# EAGLE design mapesynth_2pag (EAGLE 7.6.0)

## Sheet 1 of 2
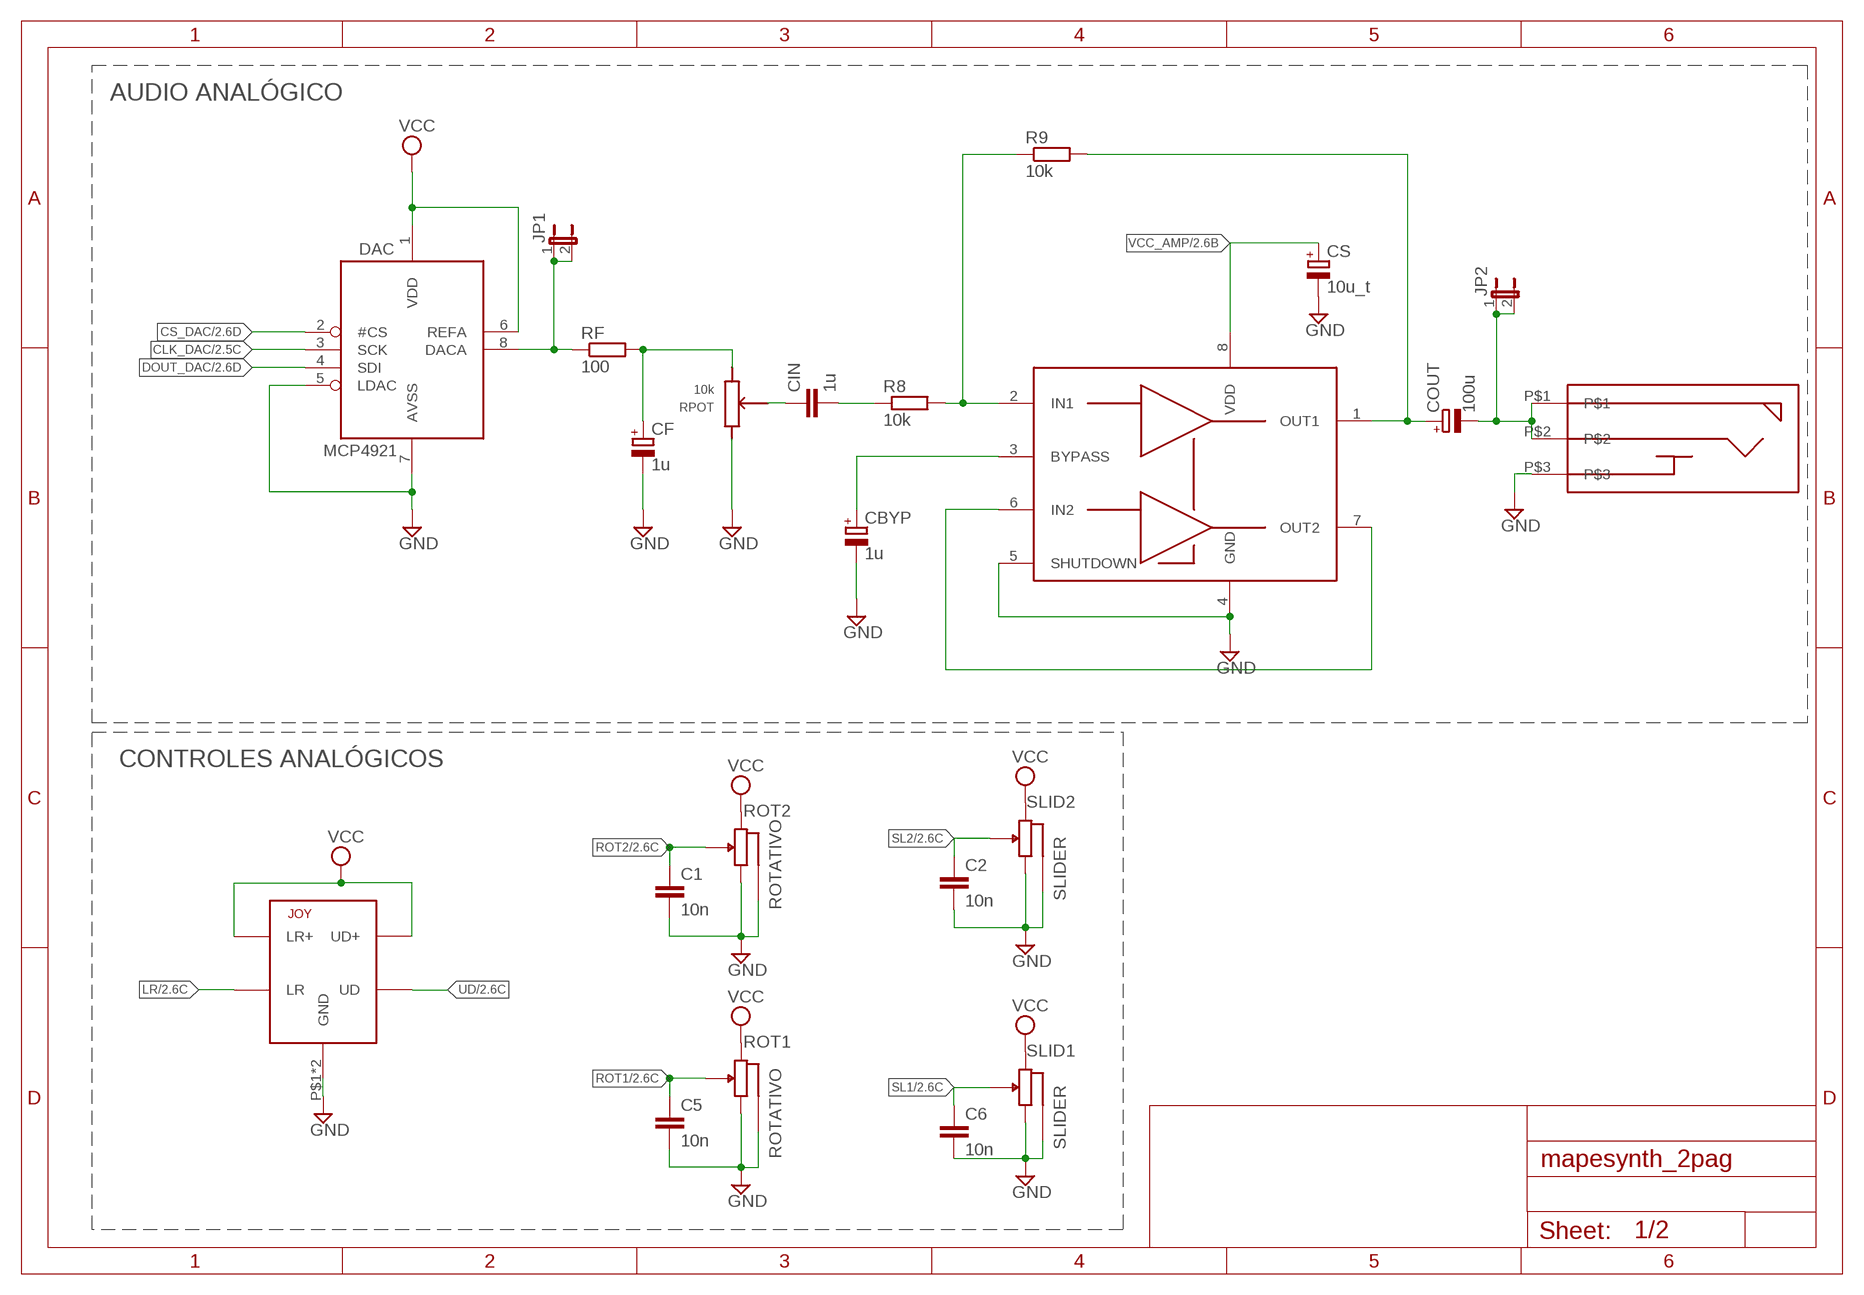
[diagram p0: schematic, sheet 1]

### Parts
AMP  TPA6111  [SO-08]
C1  10n  C-EU050-024X044  [C050-024X044]
C2  10n  C-EU050-024X044  [C050-024X044]
C5  10n  C-EU050-024X044  [C050-024X044]
C6  10n  C-EU050-024X044  [C050-024X044]
CBYP  1u  CPOL-EU153CLV-0405  [153CLV-0405]
CF  1u  CPOL-EU153CLV-0405  [153CLV-0405]
CIN  1u  C-EUC1206  [C1206]
COUT  100u  CPOL-EU153CLV-0605  [153CLV-0605]
CS  10u_t  CPOL-EUCT3528  [CT3528]
DAC  MCP4921EN_SMD  [SO-08]
JOY  JOYSTICK  [PLACAJSTICK]
JP1  JP1E  [JP1]
JP2  JP1E  [JP1]
R8  10k  R-EU_M1206  [M1206]
R9  10k  R-EU_M1206  [M1206]
RF  100  R-EU_M1206  [M1206]
ROT1  ROTATIVO  [ROTATIVO]
ROT2  ROTATIVO  [ROTATIVO]
RPOT  10k  POT_VOL  [POT_VOL]
SLID1  SLIDER  [SLIDER]
SLID2  SLIDER  [SLIDER]
U$4  JACK_3_5MM_VA  [JACK3_5MM_V2]

### Nets
CLK_DAC: DAC.3(SCK) ; also sheet 2
CS_DAC: DAC.2(#CS) ; also sheet 2
DOUT_DAC: DAC.4(SDI) ; also sheet 2
GND: AMP.4(GND) AMP.5(SHUTDOWN) C1.2 C2.2 C5.2 C6.2 CBYP.- CF.- CS.- DAC.5(LDAC) DAC.7(AVSS) JOY.P$1(GND) JOY.P$8(GND) ROT1.A ROT1.GND1(GND) ROT1.GND2(GND) ROT2.A ROT2.GND1(GND) ROT2.GND2(GND) RPOT.P$1 SLID1.1 SLID1.4(GND) SLID1.5(GND) SLID1.6(GND) SLID1.7(GND) SLID2.1 SLID2.4(GND) SLID2.5(GND) SLID2.6(GND) SLID2.7(GND) U$4.P$3 ; also sheet 2
LR: JOY.P$3(LR) JOY.P$6(LR) ; also sheet 2
N$4: DAC.8(DACA) JP1.1 JP1.2 RF.1
N$16: CF.+ RF.2 RPOT.P$3
N$17: CIN.1 RPOT.P$2
N$18: CIN.2 R8.1
N$19: AMP.2(IN1) R8.2 R9.1
N$20: AMP.1(OUT1) COUT.+ R9.2
N$21: COUT.- JP2.1 JP2.2 U$4.P$1 U$4.P$2
N$22: AMP.6(IN2) AMP.7(OUT2)
N$25: AMP.3(BYPASS) CBYP.+
ROT1: C5.1 ROT1.C ; also sheet 2
ROT2: C1.1 ROT2.C ; also sheet 2
SL1: C6.1 SLID1.2 ; also sheet 2
SL2: C2.1 SLID2.2 ; also sheet 2
UD: JOY.P$2(UD) JOY.P$7(UD) ; also sheet 2
VCC: DAC.1(VDD) DAC.6(REFA) JOY.P$4(LR+) JOY.P$5(UD+) ROT1.B ROT2.B SLID1.3 SLID2.3 ; also sheet 2
VCC_AMP: AMP.8(VDD) CS.+ ; also sheet 2

### Notes on the sheet
- AUDIO ANALÓGICO
- CONTROLES ANALÓGICOS

## Sheet 2 of 2
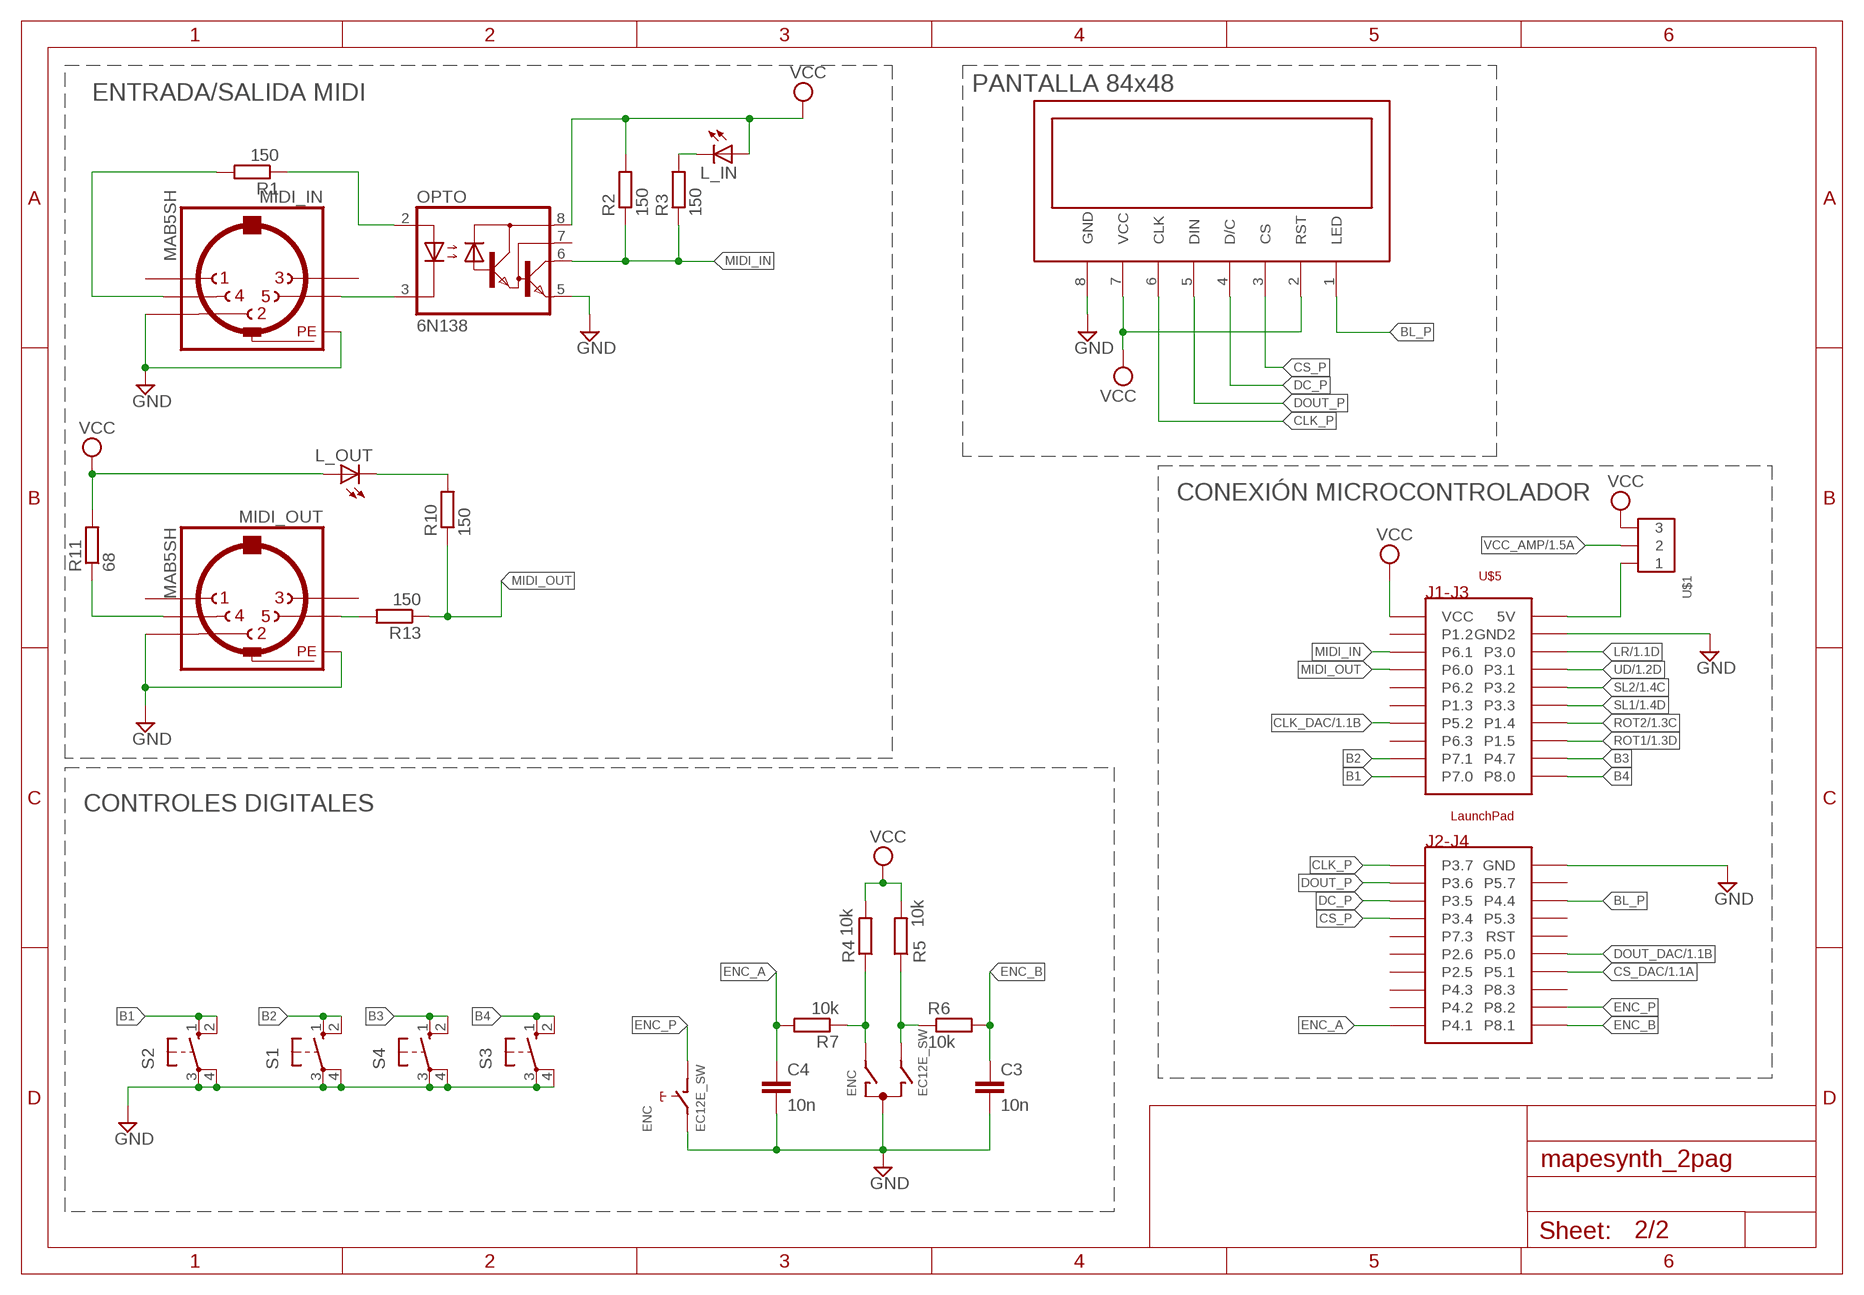
[diagram p1: schematic, sheet 2]

### Parts
C3  10n  C-EU050-024X044  [C050-024X044]
C4  10n  C-EU050-024X044  [C050-024X044]
ENC  EC12E_SW  [ALPS_EC12E_SW]
L_IN  LED5MM  [LED5MM]
L_OUT  LED5MM  [LED5MM]
MIDI_IN  MAB5SH  [MAB5SH]
MIDI_OUT  MAB5SH  [MAB5SH]
OPTO  6N138  [DIL08]
R1  150  R-EU_0207/10  [0207/10]
R2  150  R-EU_0207/10  [0207/10]
R3  150  R-EU_0207/10  [0207/10]
R4  10k  R-EU_R1206  [R1206]
R5  10k  R-EU_R1206  [R1206]
R6  10k  R-EU_R1206  [R1206]
R7  10k  R-EU_R1206  [R1206]
R10  150  R-EU_0207/10  [0207/10]
R11  68  R-EU_0207/10  [0207/10]
R13  150  R-EU_0207/10  [0207/10]
S1  40-XX  [B3F-40XX]
S2  40-XX  [B3F-40XX]
S3  40-XX  [B3F-40XX]
S4  40-XX  [B3F-40XX]
U$1  JP3  [JP3]
U$3  NOKIA_5110  [NOKIA_5110]
U$5  LAUNCHPAD_XL  [LAUNCHPAD_XL]

### Nets
B1: S2.1(S) S2.2(S1) U$5.P$10(P7.0)
B2: S1.1(S) S1.2(S1) U$5.P$9(P7.1)
B3: S4.1(S) S4.2(S1) U$5.P$29(P4.7)
B4: S3.1(S) S3.2(S1) U$5.P$30(P8.0)
BL_P: U$3.1(LED) U$5.P$18(P4.4)
CLK_DAC: U$5.P$7(P5.2) ; also sheet 1
CLK_P: U$3.6(CLK) U$5.P$40(P3.7)
CS_DAC: U$5.P$14(P5.1) ; also sheet 1
CS_P: U$3.3(CS) U$5.P$37(P3.4)
DC_P: U$3.4(D/C) U$5.P$38(P3.5)
DOUT_DAC: U$5.P$15(P5.0) ; also sheet 1
DOUT_P: U$3.5(DIN) U$5.P$39(P3.6)
ENC_A: C4.1 R7.2 U$5.P$31(P4.1)
ENC_B: C3.1 R6.2 U$5.P$11(P8.1)
ENC_P: ENC.D U$5.P$12(P8.2)
GND: C3.2 C4.2 ENC.C ENC.E MIDI_IN.2 MIDI_IN.PE MIDI_IN.PE@(PE) MIDI_OUT.2 MIDI_OUT.PE MIDI_OUT.PE@(PE) OPTO.5(GND) S1.3(P) S1.4(P1) S2.3(P) S2.4(P1) S3.3(P) S3.4(P1) S4.3(P) S4.4(P1) U$3.8(GND) U$5.P$20(GND) U$5.P$22(GND2) ; also sheet 1
LR: U$5.P$23(P3.0) ; also sheet 1
MIDI_IN: OPTO.6(VO) R2.1 R3.1 U$5.P$3(P6.1)
MIDI_OUT: R10.1 R13.1 U$5.P$4(P6.0)
N$1: MIDI_IN.4 R1.2
N$2: MIDI_IN.5 OPTO.3(C)
N$3: OPTO.2(A) R1.1
N$5: U$1.P$1 U$5.P$21(5V)
N$6: MIDI_OUT.4 R11.1
N$7: L_IN.K(C) R3.2
N$8: L_OUT.K(C) R10.2
N$12: MIDI_OUT.5 R13.2
N$14: ENC.A R4.1 R7.1
N$15: ENC.B R5.1 R6.1
ROT1: U$5.P$28(P1.5) ; also sheet 1
ROT2: U$5.P$27(P1.4) ; also sheet 1
SL1: U$5.P$26(P3.3) ; also sheet 1
SL2: U$5.P$25(P3.2) ; also sheet 1
UD: U$5.P$24(P3.1) ; also sheet 1
VCC: L_IN.A L_OUT.A OPTO.8(VCC) R2.2 R4.2 R5.2 R11.2 U$1.P$3 U$3.2(RST) U$3.7(VCC) U$5.P$1(VCC) ; also sheet 1
VCC_AMP: U$1.P$2 ; also sheet 1
Unconnected: ENC.GND1(G) ENC.GND2(G) MIDI_IN.1 MIDI_IN.3 MIDI_OUT.1 MIDI_OUT.3 OPTO.7(VB) U$5.P$2(P1.2) U$5.P$5(P6.2) U$5.P$6(P1.3) U$5.P$8(P6.3) U$5.P$13(P8.3) U$5.P$16(RST) U$5.P$17(P5.3) U$5.P$19(P5.7) U$5.P$32(P4.2) U$5.P$33(P4.3) U$5.P$34(P2.5) U$5.P$35(P2.6) U$5.P$36(P7.3)

### Notes on the sheet
- PANTALLA 84x48
- ENTRADA/SALIDA MIDI
- CONEXIÓN MICROCONTROLADOR
- CONTROLES DIGITALES

## Library data of the parts
AMP = Launch_midi_synth_v3:TPA6111
C1-C6 = rcl:C-EU: CAPACITOR, European symbol
CBYP CF COUT CS = Launch_midi_synth_v3:CPOL-EU: POLARIZED CAPACITOR, European symbol
CIN = Launch_midi_synth_v3:C-EU: CAPACITOR, European symbol
DAC = Launch_midi_synth_v3:MCP4921
ENC = switch-alps:EC12E_SW: ALPS rotary Encoder EC12E series with switch; MPN: EC12E2424407; OC_FARNELL: 1520813; OC_NEWARK: 74M1068
JOY = Launch_midi_synth_v3:JOYSTICK
JP1 JP2 = jumper:JP1E: JUMPER
L_IN L_OUT = Launch_midi_synth_v2:LED: LED OSRAM: - CHIPLED LG R971, LG N971, LY N971, LG Q971, LY Q971, LO R971, LY R971 LH N974, LH R974 LS Q976, LO Q976, LY Q976 LO Q996 - Hyper CHIPLED LW Q18S LB Q993, LB Q99A, LB R99A - SideLED LS A670, LO A670, LY A670, LG A670, LP A670 LB A673, LV A673, LT A673, LW A673 LH A674 LY A675 LS A676, LA A676, LO A676, LY A676, LW A676 LS A679, LY A679, LG A679 - Hyper Micro SIDELED® LS Y876, LA Y876, LO Y876, LY Y876 LT Y87S - SmartLED LW L88C, LW L88S LB L89C, LB L89S, LG L890 LS L89K, LO L89K, LY L89K LS L896, LA L896, LO L896, LY L896 - TOPLED LS T670, LO T670, LY T670, LG T670, LP T670 LSG T670, LSP T670, LSY T670, LOP T670, LYG T670 LG T671, LOG T671, LSG T671 LB T673, LV T673, LT T673, LW T673 LH T674 LS T676, LA T676, LO T676, LY T676, LB T676, LH T676, LSB T676, LW T676 LB T67C, LV T67C, LT T67C, LS T67K, LO T67K, LY T67K, LW E67C LS E67B, LA E67B, LO E67B, LY E67B, LB E67C, LV E67C, LT E67C LW T67C LS T679, LY T679, LG T679 LS T770, LO T770, LY T770, LG T770, LP T770 LB T773, LV T773, LT T773, LW T773 LH T774 LS E675, LA E675, LY E675, LS T675 LS T776, LA T776, LO T776, LY T776, LB T776 LHGB T686 LT T68C, LB T68C - Hyper Mini TOPLED® LB M676 - Mini TOPLED Santana® LG M470 LS M47K, LO M47K, LY M47K Source: http://www.osram.convergy.de LUXEON: - LUMILED® LXK2-PW12-R00, LXK2-PW12-S00, LXK2-PW14-U00, LXK2-PW14-V00 LXK2-PM12-R00, LXK2-PM12-S00, LXK2-PM14-U00 LXK2-PE12-Q00, LXK2-PE12-R00, LXK2-PE12-S00, LXK2-PE14-T00, LXK2-PE14-U00 LXK2-PB12-K00, LXK2-PB12-L00, LXK2-PB12-M00, LXK2-PB14-N00, LXK2-PB14-P00, LXK2-PB14-Q00 LXK2-PR12-L00, LXK2-PR12-M00, LXK2-PR14-Q00, LXK2-PR14-R00 LXK2-PD12-Q00, LXK2-PD12-R00, LXK2-PD12-S00 LXK2-PH12-R00, LXK2-PH12-S00 LXK2-PL12-P00, LXK2-PL12-Q00, LXK2-PL12-R00 Source: www.luxeon.com KINGBRIGHT: KA-3528ASYC Source: www.kingbright.com
MIDI_IN MIDI_OUT = Launch_midi_synth_v3:MAB5SH: Female CONNECTOR 5 pins 90 deg. with shield, horizontal (DIN 41524); OC_FARNELL: 809883; OC_NEWARK: unknown
OPTO = optocoupler:6N138: MOTOROLA OPTO COUPLER; MF: VISHAY/TELEFUNKEN; MPN: 6N138; OC_FARNELL: 9860150; OC_NEWARK: 35K5294
R1-R3 R10 R11 R13 = resistor:R-EU_: RESISTOR, European symbol
R4-R7 = Launch_midi_synth_v2:R-EU_: RESISTOR, European symbol
R8 R9 RF = rcl:R-EU_: RESISTOR, European symbol
ROT1 ROT2 = Launch_midi_synth_v2:ROTATIVO
RPOT = Launch_midi_synth_v3:POT_VOL
S1-S4 = adafruit:40-XX: OMRON SWITCH; MF: OMRON COMPONENTS USA; MPN: B3F-4000; OC_FARNELL: 176434; OC_NEWARK: 36K3105
SLID1 SLID2 = Launch_midi_synth_v2:SLIDER
U$1 = Launch_midi_synth_v3:JP3
U$3 = Launch_midi_synth_v3:NOKIA_5110
U$4 = Launch_midi_synth_v2:JACK_3_5MM_VA
U$5 = Launch_midi_synth_v3:LAUNCHPAD_XL

## Board
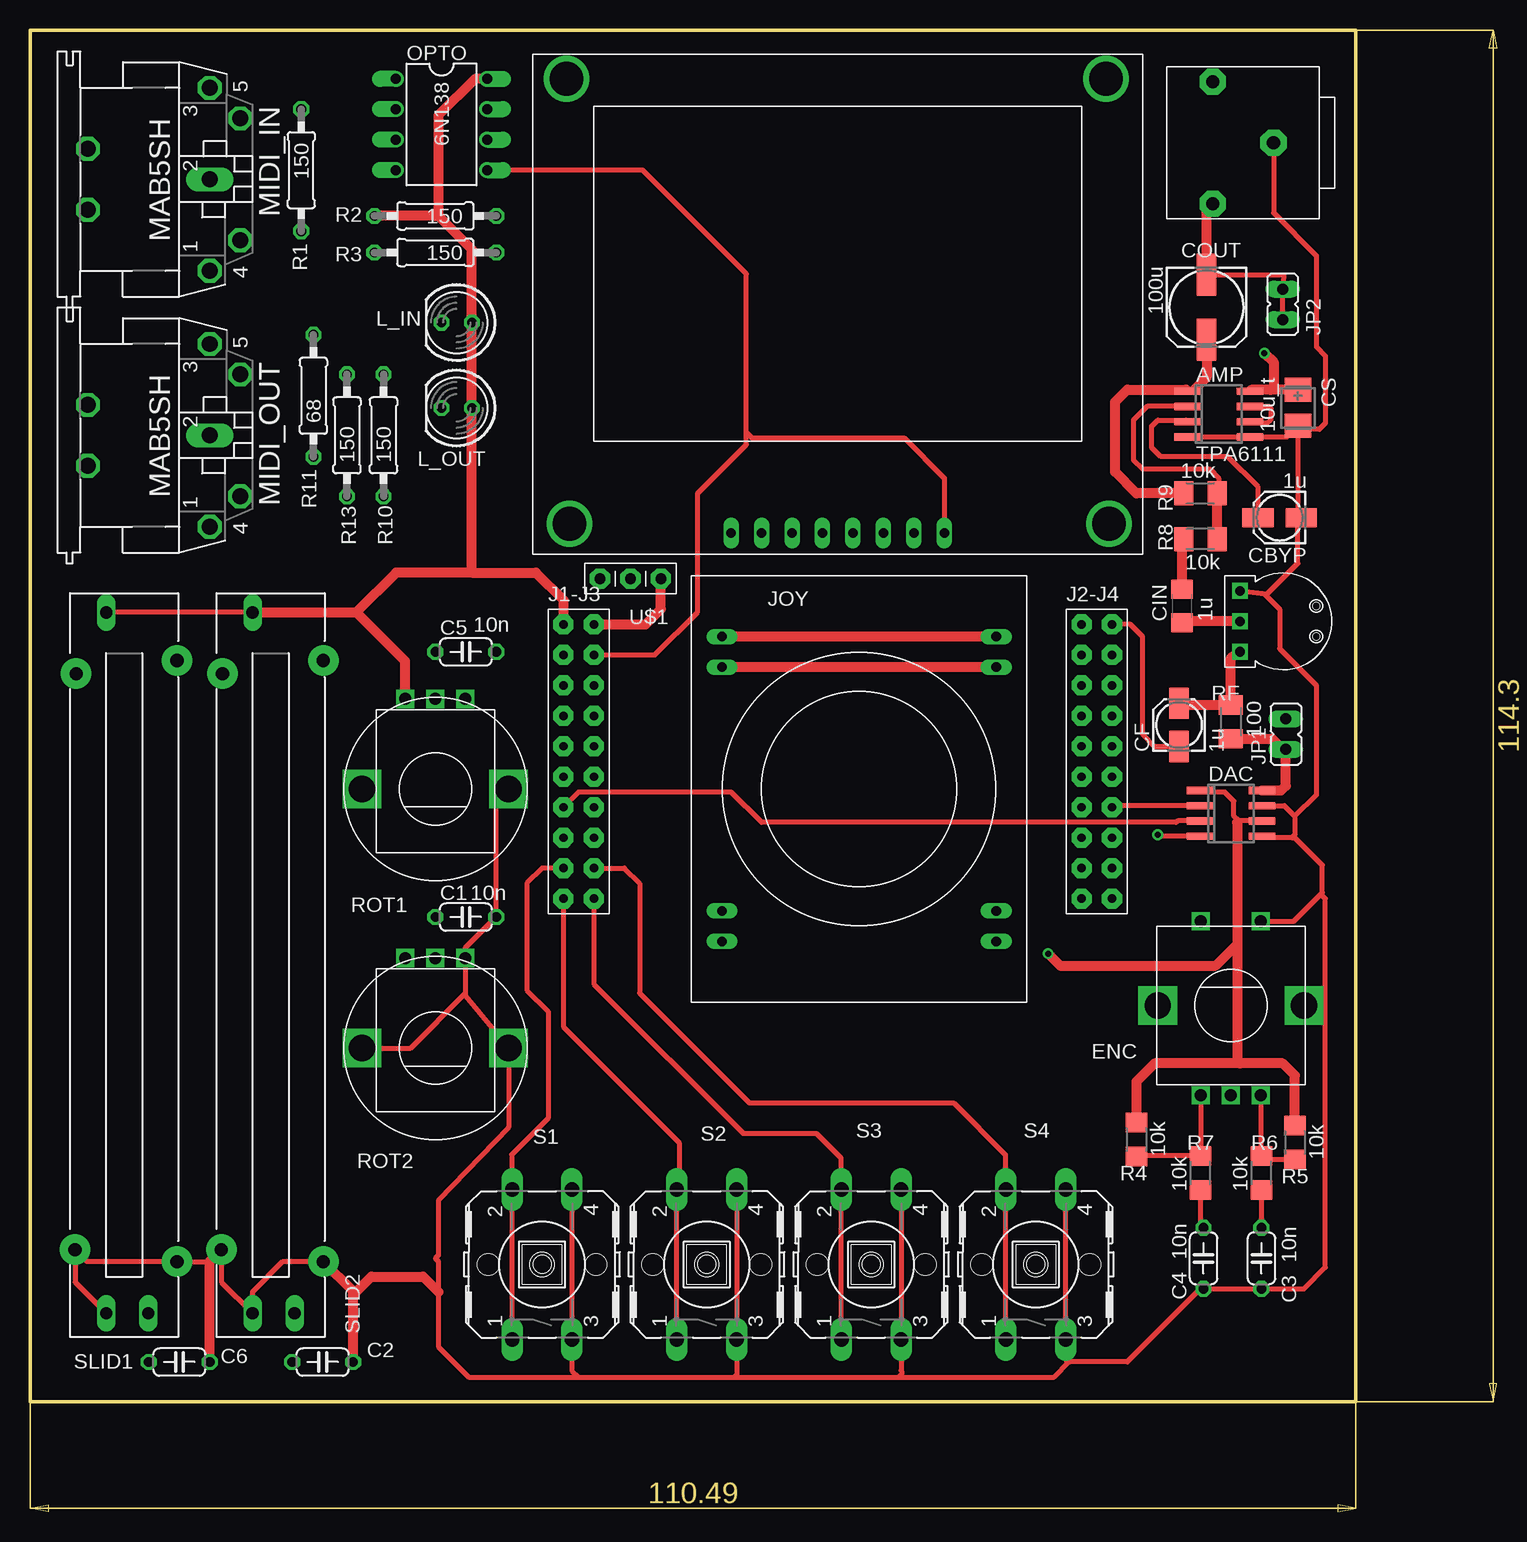
[diagram p2: board, top side]
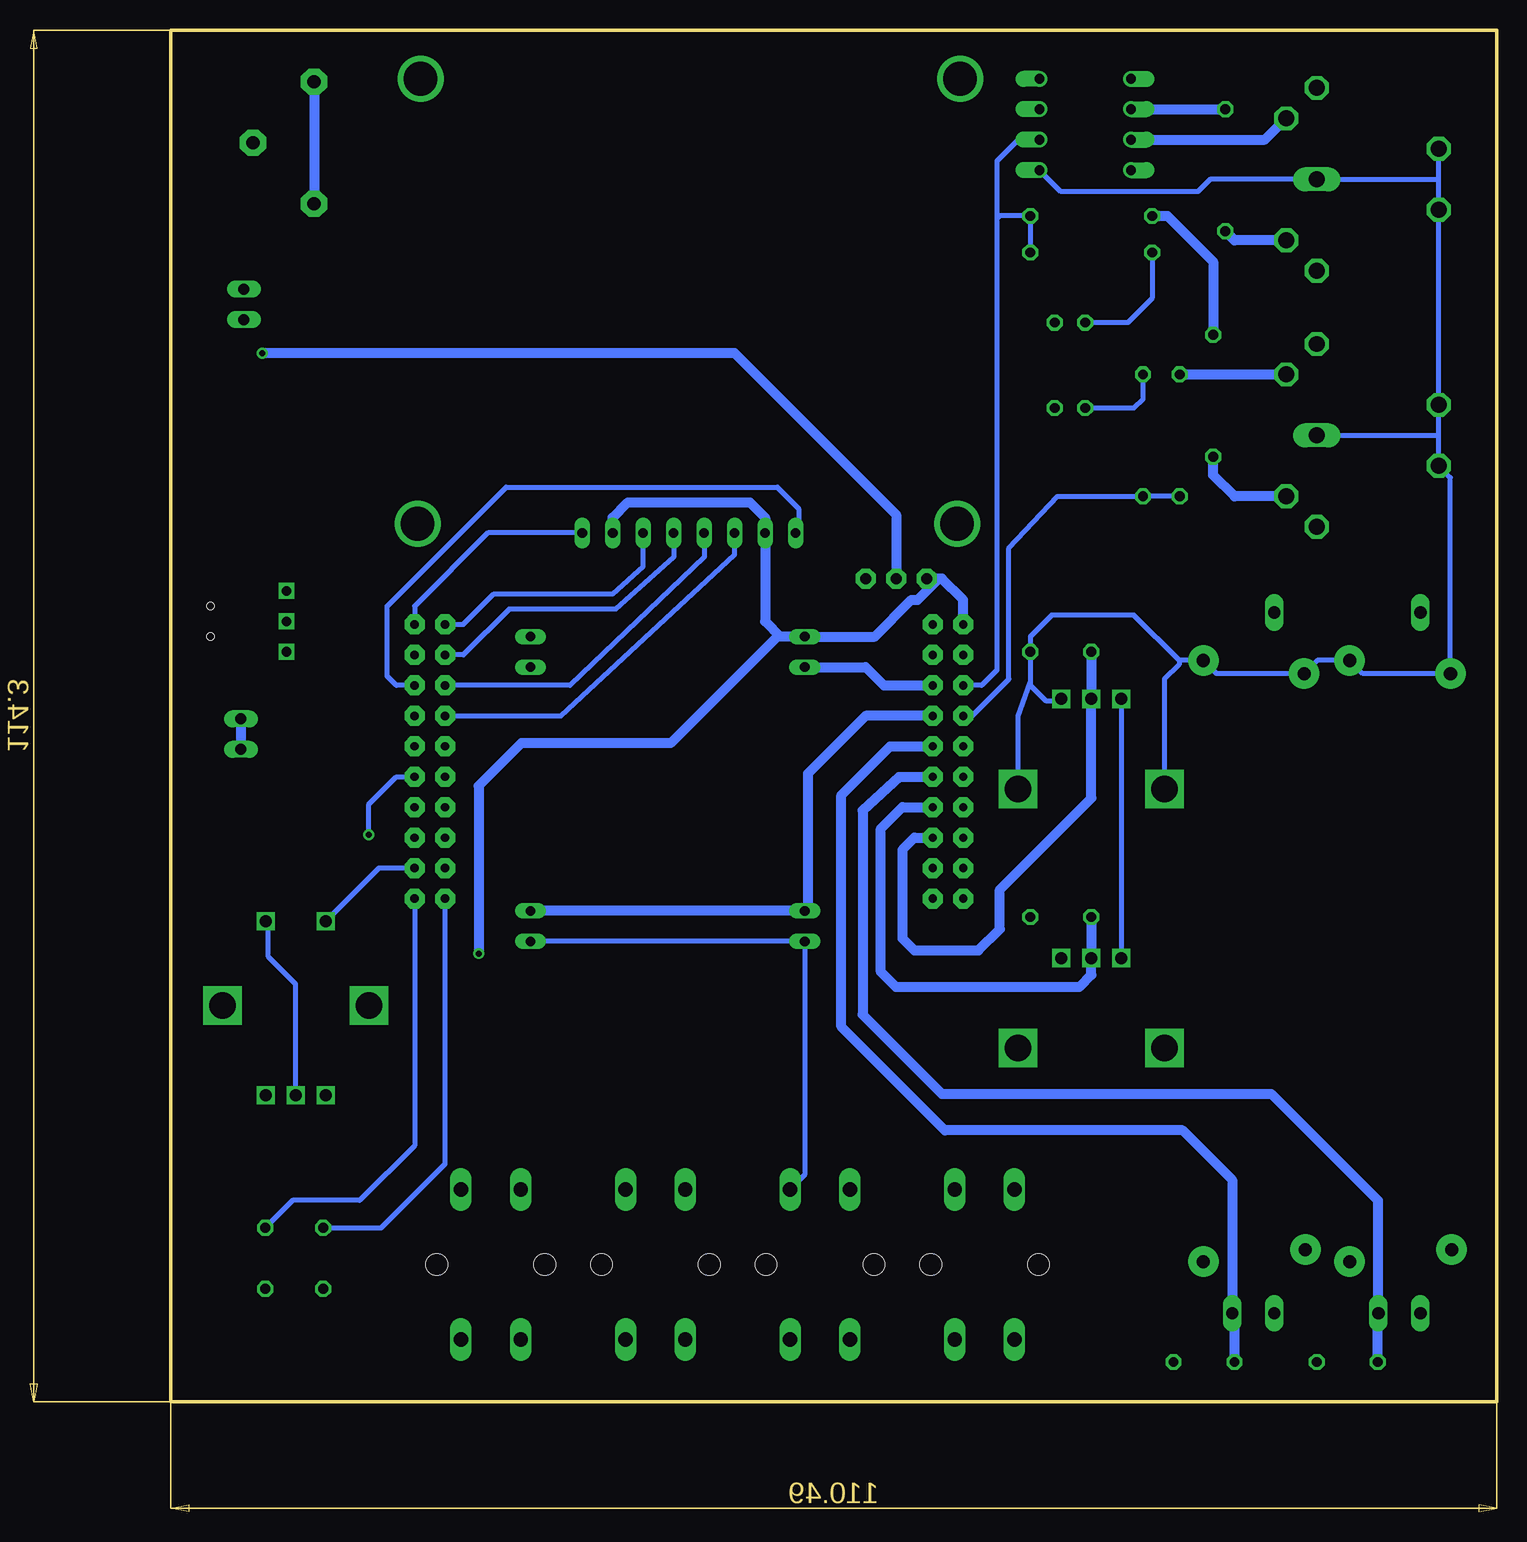
[diagram p3: board, bottom side, seen from below]

Size 110.49 x 114.3 mm. Coordinates in mm from the lower left corner, seen from the top.
Outline: 0,114.3 110.49,114.3 110.49,0 0,0 0,114.3
Copper layers (1*16): Top 0.035mm / dielectric 1.5mm / Bottom 0.035mm
Design rules "default": minimum track width 10mil, minimum drill 24mil, track to track 8mil, track to pad 8mil, pad to pad 8mil, via to via 8mil, smd to smd 8mil, copper to edge 40mil, drill to drill 8mil, minimum pad ring 10mil, minimum via ring 8mil, stop-mask expansion 4mil, vias tented up to drill 0mil, thermal gap 10mil

### Footprints (pad centres in the part's own frame; a part is rotated, then mirrored left to right if it is on the bottom)
SO-08 = smd 0.6 x 2.2: 1 -1.905,-2.6; 2 -0.635,-2.6; 3 0.635,-2.6; 4 1.905,-2.6; 5 1.905,2.6; 6 0.635,2.6; 7 -0.635,2.6; 8 -1.905,2.6
C050-024X044 = drill 0.813 octagon: 1 -2.54,0; 2 2.54,0
153CLV-0405 = smd 2.6 x 1.6: + 1.8,0; - -1.8,0
C1206 = smd 1.6 x 1.8: 1 -1.4,0; 2 1.4,0
153CLV-0605 = smd 3.5 x 1.6: + 2.7,0; - -2.7,0
CT3528 = smd 2 x 2.2: + -1.5,0; - 1.5,0
ALPS_EC12E_SW = drill 1 square: A -2.5,-7.5; B 2.5,-7.5; C 0,-7.5; D -2.5,7; E 2.5,7 | drill 2.2 square: GND1 -6.1,0; GND2 6.1,0
PLACAJSTICK = drill 0.8 long: P$1 0,0; P$2 0,2.54; P$3 0,22.86; P$4 0,25.4; P$5 22.86,25.4; P$6 22.86,22.86; P$7 22.86,2.54; P$8 22.86,0
JP1 = drill 0.914 long: 1 0,-1.27; 2 0,1.27
LED5MM = drill 0.813 octagon: A -1.27,0; K 1.27,0
MAB5SH = drill 1.321 octagon: 1 7.62,5.08; 3 -7.62,5.08; 4 5.08,7.62; 5 -5.08,7.62; PE -2.54,-5.08; PE@ 2.54,-5.08 | drill 1.321 long: 2 0,5.08
DIL08 = drill 0.813 offset: 1 -3.81,-3.81; 2 -1.27,-3.81; 3 1.27,-3.81; 4 3.81,-3.81; 5 3.81,3.81; 6 1.27,3.81; 7 -1.27,3.81; 8 -3.81,3.81
0207/10 = drill 0.813 octagon: 1 -5.08,0; 2 5.08,0
R1206 = smd 1.6 x 1.803: 1 -1.422,0; 2 1.422,0
M1206 = smd 1.6 x 2: 1 -1.4,0; 2 1.4,0
ROTATIVO = drill 1 square: A 0.04,0.12; B 5.04,0.12; C 2.54,0.12 | drill 2.2 square: GND1 -3.56,7.62; GND2 8.64,7.62
POT_VOL = drill 0.8 square: P$1 -2.54,5.08; P$2 -2.54,2.54; P$3 -2.54,0 | hole 0.6: 3.81,3.81; 3.81,1.27
B3F-40XX = drill 1.194 long: 1 -6.248,2.489; 2 6.248,2.489; 3 -6.248,-2.489; 4 6.248,-2.489 | hole 1.803: 0,-4.496; 0,4.496
SLIDER = drill 1.016 long: 1 0,0; 2 0,-3.5; 3 58.4,0 | drill 1.1 pad 2.54: 4 5.3,2.6; 5 4.3,-5.9; 6 54.4,-5.9; 7 53.3,2.5
JP3 = drill 0.9 pad 1.676 octagon: P$1 0,0; P$2 0,2.54; P$3 0,5.08
NOKIA_5110 = drill 0.8 long: 1 -22.86,3.81; 2 -20.32,3.81; 3 -17.78,3.81; 4 -15.24,3.81; 5 -12.7,3.81; 6 -10.16,3.81; 7 -7.62,3.81; 8 -5.08,3.81 | drill 2.8: 9 -36.322,4.572; 10 8.636,4.572; 11 8.382,41.656; 12 -36.576,41.656
JACK3_5MM_V2 = drill 1.1 pad 2.184 octagon: P$1 5.08,-2.54; P$2 -5.08,-2.54; P$3 0,2.54
LAUNCHPAD_XL = drill 0.7 pad 1.676 octagon: P$1 -5.08,5.08; P$2 -5.08,2.54; P$3 -5.08,0; P$4 -5.08,-2.54; P$5 -5.08,-5.08; P$6 -5.08,-7.62; P$7 -5.08,-10.16; P$8 -5.08,-12.7; P$9 -5.08,-15.24; P$10 -5.08,-17.78; P$11 40.64,-17.78; P$12 40.64,-15.24; P$13 40.64,-12.7; P$14 40.64,-10.16; P$15 40.64,-7.62; P$16 40.64,-5.08; P$17 40.64,-2.54; P$18 40.64,0; P$19 40.64,2.54; P$20 40.64,5.08; P$21 -2.54,5.08; P$22 -2.54,2.54; P$23 -2.54,0; P$24 -2.54,-2.54; P$25 -2.54,-5.08; P$26 -2.54,-7.62; P$27 -2.54,-10.16; P$28 -2.54,-12.7; P$29 -2.54,-15.24; P$30 -2.54,-17.78; P$31 38.1,-17.78; P$32 38.1,-15.24; P$33 38.1,-12.7; P$34 38.1,-10.16; P$35 38.1,-7.62; P$36 38.1,-5.08; P$37 38.1,-2.54; P$38 38.1,0; P$39 38.1,2.54; P$40 38.1,5.08

### Placement (x,y rotation side)
AMP  99.06,82.3 270 top
C1  36.32,40.39 0 top
C2  24.38,3.3 0 top
C3  102.62,11.94 270 top
C4  97.79,11.94 270 top
C5  36.32,62.48 0 top
C6  12.45,3.3 0 top
CBYP  104.14,73.66 180 top
CF  95.76,56.39 90 top
CIN  96.01,66.29 90 top
COUT  98.04,91.19 270 top
CS  105.66,82.8 270 top
DAC  100.08,49.02 270 top
ENC  100.08,33.02 0 top
JOY  57.66,38.35 0 top
JP1  104.65,55.63 0 top
JP2  104.39,91.44 0 top
L_IN  35.56,89.92 180 top
L_OUT  35.56,82.8 180 top
MIDI_IN  9.91,101.85 270 top
MIDI_OUT  9.91,80.52 270 top
OPTO  34.29,106.43 270 top
R1  22.61,102.62 270 top
R2  33.78,98.81 180 top
R3  33.78,95.76 180 top
R4  92.2,21.84 90 top
R5  105.41,21.59 90 top
R6  102.62,19.05 270 top
R7  97.54,19.05 270 top
R8  97.54,71.88 0 top
R9  97.54,75.69 180 top
R10  29.46,80.52 90 top
R11  23.62,83.82 90 top
R13  26.42,80.52 90 top
RF  100.08,56.64 90 top
ROT1  36.32,58.67 180 top
ROT2  36.32,37.08 180 top
RPOT  103.38,62.48 0 top
S1  42.67,11.43 90 top
S2  56.39,11.43 90 top
S3  70.1,11.43 90 top
S4  83.82,11.43 90 top
SLID1  6.35,7.37 90 top
SLID2  18.54,7.37 90 top
U$1  52.58,68.58 90 top
U$3  81.28,68.58 0 top
U$4  101.09,104.9 270 top
U$5  49.53,59.69 0 top

### Tracks (layer width: path | path; a pad name or v marks a point on that pad's centre or on a via)
B1
  Top 0.406: U$5.P$10 44.45,31.24 54.1,21.59 54.1,17.88 S2.2 S2.1
B2
  Top 0.406: U$5.P$9 42.67,44.45 41.4,43.18 41.4,34.29 43.18,32.51 43.18,23.62 40.13,20.57 40.13,15.95 40.16,17.03 | 40.16,17.03 S1.2 | S1.1 40.18,17.01 40.16,17.03
B3
  Top 0.406: U$5.P$29 49.53,44.45 50.8,43.18 50.8,34.04 59.94,24.89 76.96,24.89 81.28,20.57 81.28,17.73 S4.2 S4.1
B4
  Top 0.406: U$5.P$30 46.99,34.8 59.44,22.35 65.53,22.35 67.56,20.32 67.56,17.73 S3.2 68.02,17.27 68.07,17.27 67.61,16.81 S3.1
BL_P
  Bottom 0.406: U$5.P$18 91.69,59.69 92.46,60.45 92.46,66.29 82.55,76.2 59.94,76.2 58.17,74.42 58.17,72.64 U$3.1
CLK_DAC
  Top 0.406: DAC.3 95.63,48.39 95.5,48.26 60.96,48.26 58.42,50.8 45.72,50.8 U$5.P$7
CLK_P
  Bottom 0.406: U$5.P$40 86.11,64.77 83.57,67.31 73.66,67.31 71.12,69.6 U$3.6
CS_DAC
  Top 0.406: DAC.2 90.3,49.66 U$5.P$14
CS_P
  Bottom 0.406: U$5.P$37 77.98,57.15 63.5,70.61 U$3.3
DC_P
  Bottom 0.406: U$3.4 66.04,70.36 77.22,59.69 U$5.P$38
DOUT_DAC  (via drill 0.5)
  Top 0.406: DAC.4 94.11,47.12 v93.98,47.24
  Bottom 0.406: v93.98,47.24 93.98,49.78 91.69,52.07 U$5.P$15
DOUT_P
  Bottom 0.406: U$3.5 68.58,70.36 73.41,66.04 82.3,66.04 86.11,62.23 U$5.P$39
ENC_A
  Top 0.406: R7.2 97.54,14.73 C4.1
  Bottom 0.406: C4.1 92.96,14.48 87.63,19.81 U$5.P$31
ENC_B
  Top 0.406: R6.2 C3.1
  Bottom 0.406: U$5.P$11 90.17,21.34 94.74,16.76 100.33,16.76 C3.1
ENC_P
  Bottom 0.406: U$5.P$12 93.15,44.45 ENC.D
GND
  Top 0.406: AMP.4 AMP.5 104.75,80.39 CS.- | CS.- 105.66,73.94 CBYP.- 105.66,73.38 105.66,69.85 103.12,67.31 RPOT.P$1 102.87,67.31 104.14,66.04 104.14,62.74 107.19,59.69 107.19,50.55 105.41,48.77 | DAC.7 104.52,49.66 105.41,48.77 | 105.41,48.77 105.41,47.24 105.16,46.99 | 105.16,46.99 102.8,46.99 DAC.5 | CF.- 93.75,54.59 92.71,55.63 92.71,63.75 91.69,64.77 U$5.P$20 | 105.16,46.99 105.41,46.99 107.7,44.7 107.7,42.42 107.57,42.29 | U$4.P$3 103.63,99.06 107.19,95.5 107.19,87.88 107.95,87.12 107.95,81.53 107.44,81.03 105.94,81.03 CS.- | ENC.E 105.3,40.02 107.57,42.29 | 107.57,42.29 107.95,41.91 107.95,11.18 106.17,9.4 C3.2 C4.2 97.54,9.4 91.44,3.3 86.61,3.3 | 86.61,3.3 86.41,3.3 S4.3 S4.4 | SLID1.1 3.75,9.97 SLID1.4 4.75,11.67 SLID1.5 14.94,11.67 SLID2.4 15.94,9.97 SLID2.1 18.54,9.14 21.08,11.68 24.42,11.68 SLID2.5 | 45.72,2.03 36.58,2.03 34.04,4.57 34.04,9.14 34.04,11.68 33.78,11.94 34.04,12.19 34.04,16.76 39.88,22.86 ROT2.GND1 36.28,33.83 36.28,34.04 | 45.72,2.03 58.67,2.03 | 58.67,2.03 72.39,2.03 | 72.39,2.03 85.34,2.03 86.61,3.3 | 72.39,2.03 72.64,2.29 72.64,2.54 72.59,2.59 S3.3 S3.4 | S2.4 S2.3 58.88,2.23 58.67,2.03 | S1.4 S1.3 45.16,2.59 45.72,2.03 | 36.28,34.04 ROT2.A 36.28,37.81 C1.2 38.86,50.03 ROT1.GND1 | U$5.P$22 52.07,62.23 55.63,65.79 55.63,75.69 59.69,79.76 59.69,80.77 | U$3.8 76.2,76.96 72.9,80.26 60.2,80.26 59.69,80.77 | ROT2.GND2 31.71,29.46 36.28,34.04 | 59.69,80.77 59.69,93.98 51.05,102.62 OPTO.5
  Top 0.813: C6.2 14.99,11.71 SLID2.4 | SLID2.5 26.92,9.18 C2.2 26.92,8.89 28.45,10.41 32.77,10.41 34.04,9.14
  Bottom 0.406: U$3.8 84.07,72.39 90.17,66.29 U$5.P$20 | 4.83,101.85 MIDI_IN.2 23.88,101.85 24.89,100.84 36.32,100.84 OPTO.5 | 4.83,101.85 MIDI_IN.PE@ MIDI_OUT.PE 4.83,80.52 | 4.83,101.85 MIDI_IN.PE | ENC.C 100.08,34.8 102.36,37.08 102.36,39.81 ENC.E | JOY.P$8 JOY.P$1 57.66,18.9 S2.4 | 38.86,59.94 C5.2 38.86,63.75 37.08,65.53 30.23,65.53 26.46,61.77 | 38.86,59.94 38.86,59.69 37.59,58.42 36.42,58.42 ROT1.A | ROT1.GND1 39.88,57.15 38.86,59.94 | 26.46,61.77 SLID2.6 23.34,60.67 SLID2.7 14.94,61.77 SLID1.6 11.15,60.67 SLID1.7 3.85,77 MIDI_OUT.PE@ 4.83,80.52 | 26.46,61.77 26.46,61.42 27.69,60.2 ROT1.GND2 | MIDI_OUT.2 4.83,80.52
  cutout Bottom (isolate 0.406): 0,114.3 110.49,114.3 110.49,0 0,0
  cutout Top (isolate 0.305): 0,114.3 110.49,114.3 110.49,0 0,0
LR
  Top 0.813: JOY.P$6 JOY.P$3
  Bottom 0.813: JOY.P$3 52.58,61.21 51.05,59.69 U$5.P$23
MIDI_IN
  Bottom 0.406: OPTO.6 39.88,105.16 41.66,103.38 41.66,98.55 | 41.66,98.55 41.66,60.96 42.93,59.69 U$5.P$3 | R3.1 R2.1 41.4,98.81 41.66,98.55
MIDI_OUT
  Bottom 0.406: R13.1 R10.1 36.58,75.44 40.64,71.12 40.64,60.2 43.69,57.15 U$5.P$4
N$1
  Bottom 0.813: MIDI_IN.4 21.84,96.77 R1.2
N$2
  Bottom 0.813: OPTO.3 19.3,105.16 MIDI_IN.5
N$3
  Bottom 0.813: OPTO.2 R1.1
N$4
  Top 0.406: 104.65,54.1 JP1.1
  Top 0.813: DAC.8 104.27,50.93 104.65,51.31 104.65,54.1 103.51,55.24 RF.1
  Bottom 0.813: JP1.2 JP1.1
N$5
  Top 0.813: U$5.P$21 51.31,64.77 52.58,66.04 U$1.P$1
N$6
  Bottom 0.813: MIDI_OUT.4 21.84,75.44 23.62,77.22 R11.1
N$7
  Bottom 0.406: R3.2 28.7,91.95 30.73,89.92 L_IN.K
N$8
  Bottom 0.406: L_OUT.K 30.23,82.8 29.46,83.57 R10.2
N$12
  Bottom 0.813: R13.2 MIDI_OUT.5
N$14
  Top 0.406: ENC.A 97.58,20.51 R7.1 92.25,20.47 R4.1
N$15
  Top 0.406: ENC.B 102.58,20.51 R6.1 102.92,20.17 R5.1
N$16
  Top 0.406: 96.67,58.04 CF.+
  Top 0.813: 96.67,58.04 RF.2 100.08,61.98 RPOT.P$3
N$17
  Top 0.406: 96.27,65.02 96.27,64.77 96.14,64.77 CIN.1
  Top 0.813: RPOT.P$2 96.27,65.02
N$18
  Top 0.406: 96.01,71.76 R8.1
  Top 0.813: CIN.2 96.01,71.76
N$19
  Top 0.406: AMP.2 93.09,82.93 91.95,81.79 91.95,78.49 92.71,77.72 98.3,77.72 99.06,76.96 99.06,75.82 R9.1
  Top 0.813: R8.2 R9.1
N$20
  Top 0.406: 96.33,84.33 AMP.1 96.59,84.33 97.03,84.33
  Top 0.813: R9.2 92.2,75.69 90.42,77.47 90.42,83.31 91.44,84.33 96.33,84.33 | COUT.+ 98.04,85.34 97.03,84.33
N$21
  Top 0.406: JP2.1 JP2.2 104.49,93.89 COUT.-
  Top 0.813: COUT.- 98.04,99.31 U$4.P$1
  Bottom 0.813: U$4.P$2 U$4.P$1
N$22
  Top 0.406: AMP.7 103.25,82.93 103.38,82.8 103.38,81.79 103.12,81.53 101.79,81.53 AMP.6
N$25
  Top 0.406: CBYP.+ 102.34,76.22 99.82,78.74 94.23,78.74 93.47,79.5 93.47,81.28 93.98,81.79 96.33,81.79 AMP.3
ROT1
  Bottom 0.813: C5.1 ROT1.C 33.78,50.29 41.4,42.67 41.4,39.37 43.18,37.59 48.51,37.59 49.53,38.61 49.53,45.97 48.51,46.99 U$5.P$28
ROT2
  Bottom 0.813: C1.1 ROT2.C 33.78,35.56 34.8,34.54 50.04,34.54 51.31,35.81 51.31,47.75 49.53,49.53 U$5.P$27
SL1
  Bottom 0.406: 9.91,7.42 SLID1.2
  Bottom 0.813: 9.91,7.42 9.91,16.76 18.8,25.65 46.23,25.65 52.83,32.26 52.83,49.28 49.78,52.07 U$5.P$26 | C6.1 9.91,7.31 SLID1.2
SL2
  Bottom 0.813: C2.1 21.84,7.17 SLID2.2 22.04,18.49 26.16,22.61 45.97,22.61 54.61,31.24 54.61,50.55 50.55,54.61 U$5.P$25
UD
  Bottom 0.406: 57.4,41.15 JOY.P$2
  Bottom 0.813: U$5.P$24 52.58,57.15 57.4,52.32 57.4,41.15 | JOY.P$2 JOY.P$7
VCC  (via drill 0.5)
  Top 0.406: DAC.6 100.71,48.39 | 100.71,48.39 100.33,48.77 100.33,50.04 99.57,50.8 97.6,50.8 DAC.1 | 100.58,48.26 100.71,48.39 | 100.58,28.45 100.84,28.19 | SLID2.3 SLID1.3 | 34.04,98.81 33.78,98.81 34.04,99.06
  Top 0.813: R5.2 105.41,27.18 104.39,28.19 100.84,28.19 93.73,28.19 92.2,26.67 R4.2 | 100.58,48.26 100.58,38.1 | 100.58,38.1 100.58,28.45 | v84.84,37.34 85.85,36.32 98.81,36.32 100.58,38.1 | 34.04,98.81 36.83,96.01 L_IN.A L_OUT.A 36.83,69.09 | 33.78,98.81 R2.2 | OPTO.8 37.08,110.24 34.04,107.19 34.04,99.06 | 36.83,69.09 36.7,69.22 | SLID2.3 27.2,65.77 | 27.2,65.77 31.24,61.72 31.24,58.59 ROT1.B | 36.83,69.09 30.52,69.09 27.2,65.77 | JOY.P$5 JOY.P$4 | 36.83,69.09 42.16,69.09 44.45,66.8 U$5.P$1
  Bottom 0.406: 59.69,63.75 59.94,63.75 | ROT1.B ROT2.B
  Bottom 0.813: U$3.7 73.66,73.66 72.39,74.93 62.23,74.93 60.96,73.66 U$3.2 60.96,65.02 59.69,63.75 JOY.P$4 51.82,63.75 48.77,66.8 48.26,66.8 46.48,68.58 | 59.94,63.75 68.83,54.86 81.28,54.86 84.84,51.31 v84.84,37.34 | R2.2 27.43,98.81 23.62,95 R11.2 | U$5.P$1 44.45,66.8 46.23,68.58 46.48,68.58 | 46.48,68.58 U$1.P$3
VCC_AMP  (via drill 0.5)
  Top 0.406: 101.76,84.3 AMP.8 | 103.63,84.56 103.38,84.3
  Top 0.813: CS.+ 103.38,84.3 101.76,84.3 | v102.87,87.38 103.63,86.61 103.63,84.56
  Bottom 0.813: v102.87,87.38 63.5,87.38 50.04,73.91 U$1.P$2